# Altium schematic sheet EVK-NORA-W1_SCHEM_0004_Interface_FTDI.SchDoc
size B; Date: 7/24/2020; CompanyName: U-blox; DrawnBy: EMOO; Engineer: EMOO; Organization: U-blox; Address1: 3950 Fairview Industrial Dr SE #100; Address2: Salem, OR 97302; SheetNumber: 6; SheetTotal: 6; SheetSize: B; SheetTitle: Interface MCU
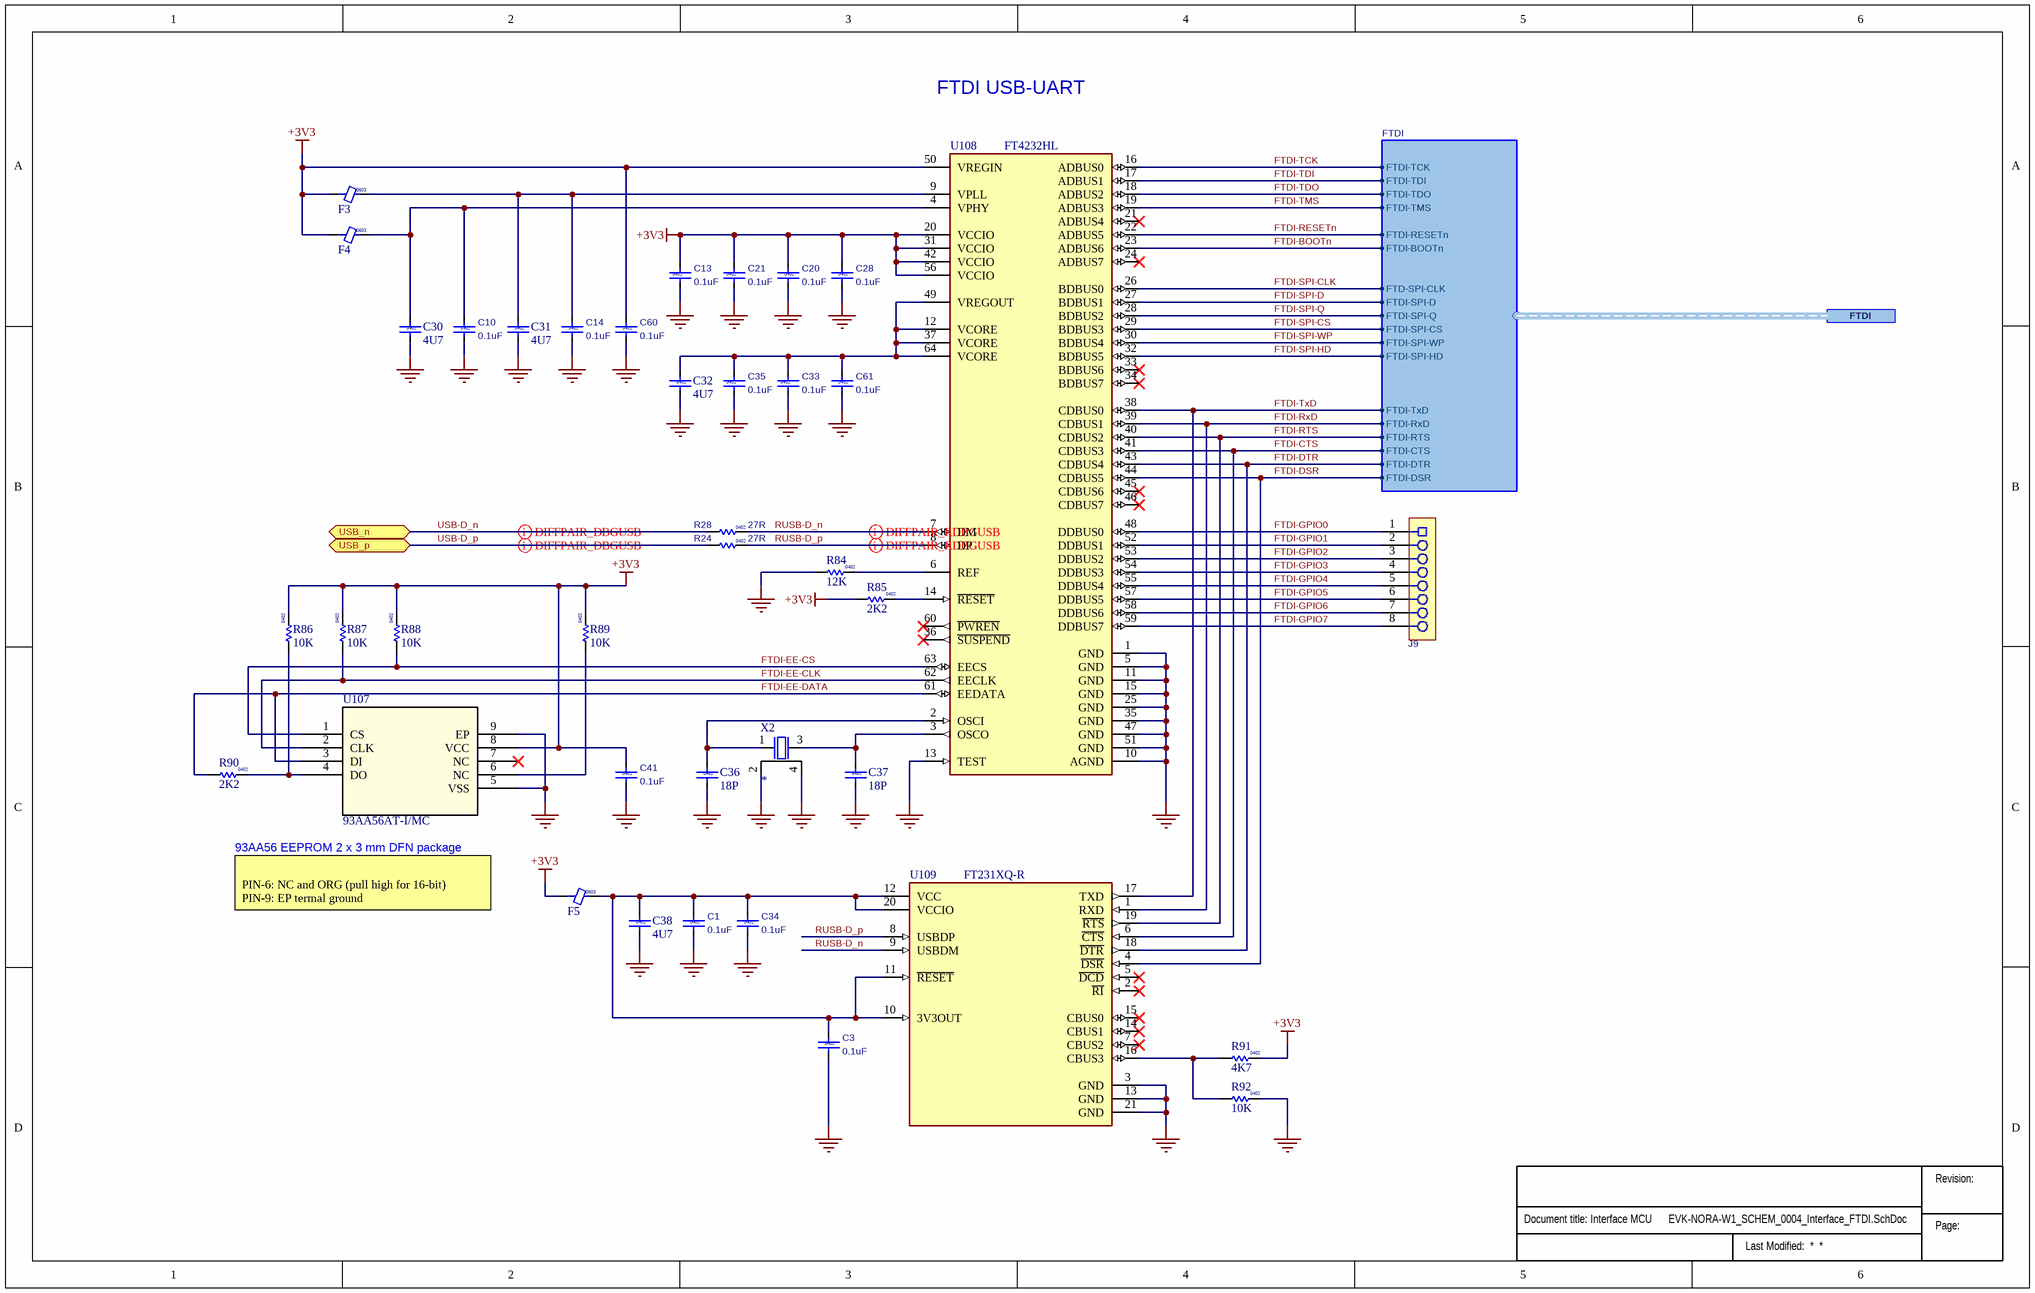
[diagram p0: EVK-NORA-W1_SCHEM_0004_Interface_FTDI.SchDoc]

## Parts
?  (no value)  (graphical)
C1  value 0.1uF  Size: 0402  [Cap 0402 HD]  (hidden comment: 120-000160.1uF)
C3  value 0.1uF  Size: 0402  [Cap 0402 HD]  (hidden comment: 120-000160.1uF)
C10  value 0.1uF  Size: 0402  [Cap 0402 HD]  (hidden comment: 120-000160.1uF)
C13  value 0.1uF  Size: 0402  [Cap 0402 HD]  (hidden comment: 120-000160.1uF)
C14  value 0.1uF  Size: 0402  [Cap 0402 HD]  (hidden comment: 120-000160.1uF)
C20  value 0.1uF  Size: 0402  [Cap 0402 HD]  (hidden comment: 120-000160.1uF)
C21  value 0.1uF  Size: 0402  [Cap 0402 HD]  (hidden comment: 120-000160.1uF)
C28  value 0.1uF  Size: 0402  [Cap 0402 HD]  (hidden comment: 120-000160.1uF)
C30  value 4U7  Size: 0402  [Cap 0402 HD]
C31  value 4U7  Size: 0402  [Cap 0402 HD]
C32  value 4U7  Size: 0402  [Cap 0402 HD]
C33  value 0.1uF  Size: 0402  [Cap 0402 HD]  (hidden comment: 120-000160.1uF)
C34  value 0.1uF  Size: 0402  [Cap 0402 HD]  (hidden comment: 120-000160.1uF)
C35  value 0.1uF  Size: 0402  [Cap 0402 HD]  (hidden comment: 120-000160.1uF)
C36  value 18P  Size: 0402  [Cap 0402]
C37  value 18P  Size: 0402  [Cap 0402]
C38  value 4U7  Size: 0402  [Cap 0402 HD]
C41  value 0.1uF  Size: 0402  [Cap 0402 HD]  (hidden comment: 120-000160.1uF)
C60  value 0.1uF  Size: 0402  [Cap 0402 HD]  (hidden comment: 120-000160.1uF)
C61  value 0.1uF  Size: 0402  [Cap 0402 HD]  (hidden comment: 120-000160.1uF)
F3  Size: 0603  [IND 0603 HD]
F4  Size: 0603  [IND 0603 HD]
F5  Size: 0603  [IND 0603 HD]
J9  (no value)  [SKT-0.1P-SSM-108-L-SV]
R24  value 27R  Size: 0402  [RES 0402 HD]
R28  value 27R  Size: 0402  [RES 0402 HD]
R84  value 12K  Size: 0402  [RES 0402 HD]
R85  value 2K2  Size: 0402  [RES 0402 HD]
R86  value 10K  Size: 0402  [RES 0402 HD]
R87  value 10K  Size: 0402  [RES 0402 HD]
R88  value 10K  Size: 0402  [RES 0402 HD]
R89  value 10K  Size: 0402  [RES 0402 HD]
R90  value 2K2  Size: 0402  [RES 0402 HD]
R91  value 4K7  Size: 0402  [RES 0402 HD]
R92  value 10K  Size: 0402  [RES 0402 HD]
U107  93AA56AT-I/MC  [DFN0.5P-8Pin_W-Pad]
U108  FT4232HL  [QFP0.5P16x16-64Pin_HD]
U109  FT231XQ-R  [QFN_5x5_FT231XQ]
X2  (no value)  [XTAL_3225]

## Ports
FTDI (harness FTDI), USB_n (bidir), USB_p (bidir)

## Harnesses
FTDI: FTDI-TCK, FTDI-TDI, FTDI-TDO, FTDI-TMS, FTDI-RESETn, FTDI-BOOTn, FTD-SPI-CLK, FTDI-SPI-D, FTDI-SPI-Q, FTDI-SPI-CS, FTDI-SPI-WP, FTDI-SPI-HD, FTDI-TxD, FTDI-RxD, FTDI-RTS, FTDI-CTS, FTDI-DTR, FTDI-DSR

## Nets
+3V3: C13.1 C20.1 C21.1 C28.1 C41.1 C60.1 F3.1 F4.1 F5.1 R85.1 R86.2 R87.2 R88.2 R89.2 R91.2 U107.8(VCC) U108.20(VCCIO) U108.31(VCCIO) U108.42(VCCIO) U108.50(VREGIN) U108.56(VCCIO)
GND: C1.2 C3.2 C10.2 C13.2 C14.2 C20.2 C21.2 C28.2 C30.2 C31.2 C32.2 C33.2 C34.2 C35.2 C36.2 C37.2 C38.2 C41.2 C60.2 C61.2 R84.1 R92.2 U107.5(VSS) U107.9(EP) U108.1(GND) U108.5(GND) U108.10(AGND) U108.11(GND) U108.13(TEST) U108.15(GND) U108.25(GND) U108.35(GND) U108.47(GND) U108.51(GND) U109.3(GND) U109.13(GND) U109.21(GND) X2.2 X2.4
FTDI-BOOTn: U108.23(ADBUS6) ; port FTDI.FTDI-BOOTn
FTDI-CTS: U108.41(CDBUS3) U109.6(~{CTS}) ; port FTDI.FTDI-CTS
FTDI-DSR: U108.44(CDBUS5) U109.4(~{DSR}) ; port FTDI.FTDI-DSR
FTDI-DTR: U108.43(CDBUS4) U109.18(~{DTR}) ; port FTDI.FTDI-DTR
FTDI-EE-CLK: R87.1 U107.2(CLK) U108.62(EECLK)
FTDI-EE-CS: R88.1 U107.1(CS) U108.63(EECS)
FTDI-EE-DATA: R90.1 U107.3(DI) U108.61(EEDATA)
FTDI-GPIO0: J9.1 U108.48(DDBUS0)
FTDI-GPIO1: J9.2 U108.52(DDBUS1)
FTDI-GPIO2: J9.3 U108.53(DDBUS2)
FTDI-GPIO3: J9.4 U108.54(DDBUS3)
FTDI-GPIO4: J9.5 U108.55(DDBUS4)
FTDI-GPIO5: J9.6 U108.57(DDBUS5)
FTDI-GPIO6: J9.7 U108.58(DDBUS6)
FTDI-GPIO7: J9.8 U108.59(DDBUS7)
FTDI-RESETn: U108.22(ADBUS5) ; port FTDI.FTDI-RESETn
FTDI-RTS: U108.40(CDBUS2) U109.19(~{RTS}) ; port FTDI.FTDI-RTS
FTDI-RxD: U108.39(CDBUS1) U109.1(RXD) ; port FTDI.FTDI-RxD
FTDI-SPI-CLK: U108.26(BDBUS0) ; port FTDI.FTD-SPI-CLK
FTDI-SPI-CS: U108.29(BDBUS3) ; port FTDI.FTDI-SPI-CS
FTDI-SPI-D: U108.27(BDBUS1) ; port FTDI.FTDI-SPI-D
FTDI-SPI-HD: U108.32(BDBUS5) ; port FTDI.FTDI-SPI-HD
FTDI-SPI-Q: U108.28(BDBUS2) ; port FTDI.FTDI-SPI-Q
FTDI-SPI-WP: U108.30(BDBUS4) ; port FTDI.FTDI-SPI-WP
FTDI-TCK: U108.16(ADBUS0) ; port FTDI.FTDI-TCK
FTDI-TDI: U108.17(ADBUS1) ; port FTDI.FTDI-TDI
FTDI-TDO: U108.18(ADBUS2) ; port FTDI.FTDI-TDO
FTDI-TMS: U108.19(ADBUS3) ; port FTDI.FTDI-TMS
FTDI-TxD: U108.38(CDBUS0) U109.17(TXD) ; port FTDI.FTDI-TxD
RUSB-D_n: R28.1 U108.7(DM) U109.9(USBDM)
RUSB-D_p: R24.1 U108.8(DP) U109.8(USBDP)
USB-D_n: R28.2 ; port USB_n
USB-D_p: R24.2 ; port USB_p
NetC1_1: C1.1 C3.1 C34.1 C38.1 F5.2 U109.10(3V3OUT) U109.11(~{RESET}) U109.12(VCC) U109.20(VCCIO)
NetC10_1: C10.1 C30.1 F4.2 U108.4(VPHY)
NetC14_1: C14.1 C31.1 F3.2 U108.9(VPLL)
NetC32_1: C32.1 C33.1 C35.1 C61.1 U108.12(VCORE) U108.37(VCORE) U108.49(VREGOUT) U108.64(VCORE)
NetC36_1: C36.1 U108.2(OSCI) X2.1
NetC37_1: C37.1 U108.3(OSCO) X2.3
NetR84_2: R84.2 U108.6(REF)
NetR85_2: R85.2 U108.14(~{RESET})
NetR86_1: R86.1 R90.2 U107.4(DO)
NetR89_1: R89.1 U107.6(NC)
NetR91_1: R91.1 R92.1 U109.16(CBUS3)

Not connected (* = marked no-connect by the designer): U107 7(NC)*; U108 21(ADBUS4)* 24(ADBUS7)* 33(BDBUS6)* 34(BDBUS7)* 36(~{SUSPEND})* 45(CDBUS6)* 46(CDBUS7)* 60(~{PWREN})*; U109 2(~{RI})* 5(~{DCD})* 7(CBUS2)* 14(CBUS1)* 15(CBUS0)*

## Layout directives
differential pair; net class USB_DIFF: RUSB-D_n, RUSB-D_p, USB-D_n, USB-D_p

## Notes on the sheet
- FTDI USB-UART
- 93AA56 EEPROM 2 x 3 mm DFN package
- PIN-6: NC and ORG (pull high for 16-bit)
  PIN-9: EP termal ground
- Revision:
- Page:

## Library data of the parts
? = Sub_Title_Block: Minimized schematic title block for all subset sheets
C1 C3 C10 C13 C14 C20 C21 C28 C33-C35 C41 C60 C61 = 120-00016: Cap, Ceramic 0.1uF 10V 10% X5R 0402; Part Name: CAP CER 0.1UF 10V 10% X5R 0402; Part_Type: Ceramic Capacitor; Manufacturer: Murata Electronics North America; Manufacturer P/N: GRM155R61A104KA01J; Item_Phase: Production; Component Mounting Type: SMT; Tolerance: +/- 10%; Use in new designs: Yes; Part Number: 120-00016; Revision: 0A; Supplier 1: Digi-Key; Supplier Part Number 1: 490-6297-1-ND; Manufacturer 2: Yageo; Manufacturer P/N 2: CC0402KRX5R6BB104; Supplier 2: Digi-Key; Supplier Part Number 2: 311-1336-1-ND; Arena Link: https://app.bom.com/a/GYHPV2L2L43KRMBK?v=spec.summary; Height: 0.55mm; Pins: 2; Temperature Coefficient: X5R; Voltage: 10V
C30-C32 C38 = UBXH01-0000243: CAP CER X5R 0402 4U7 20% 10V; Manufacturer: Murata Manufacturing Company, Ltd.; Manufacturer P/N: GRM155R61A475MEAA; Editor: martin.pilik; Released by: fabrice.bret-dibat; Env: GREEN; Permitted Use: Volume Products; Perferred: PREF; Mfg P/N Status: Active; Mfg P/N Split: 100; Mfg P/N Released: Yes; Part Number: UBXH01-0000243; Tolerance: 20%; Max Voltage: 10V; Min Operating Temp: -40°C; Max Operating Temp: 85°C; Part Type: Capacitor; Release Data: 2021-05-10 12:57:47.325652; UBX Wiki: https://wiki.u-blox.com/bin/view/Operations/PartDetails?index=24303; RefDes: C; Mfg P/N Datasheet: https://wiki.u-blox.com/bin/view/Generic/Docs/DocumentSummary?index=24302
C36 C37 = UBXH01-0004017: CAP CER C0G 0402 18P 5% 25V; Manufacturer: Murata Manufacturing Company, Ltd.; Manufacturer P/N: GRM1555C1H180JA01; Editor: doris.zahnd; Released by: daniel.hurni; Env: ROHS; Permitted Use: Volume Products; Perferred: PREF; Mfg P/N Status: NRND; Mfg P/N Split: 100; Mfg P/N Released: Yes; Part Number: UBXH01-0004017; Tolerance: 5%; Max Voltage: 25V; Min Operating Temp: -55°C; Max Operating Temp: 125°C; Part Type: Capacitor; Release Data: 2009-12-03 17:48:42.813059; UBX Wiki: https://wiki.u-blox.com/bin/view/Operations/PartDetails?index=5178; RefDes: C; Manufacturer 2: Murata Manufacturing Company, Ltd.; Manufacturer P/N 2: GRM1555C1E180JZ01; Mfg P/N Status 2: Obsolete; Mfg P/N Split 2: 0; Mfg P/N Released 2: Yes; Manufacturer 3: Murata Manufacturing Company, Ltd.; Manufacturer P/N 3: GRM1555C1H180JZ01; Mfg P/N Status 3: Obsolete; Mfg P/N Split 3: 0; Mfg P/N Released 3: Yes
F3-F5 = UBXH08-0000001: FERRITE BEAD 0603 600 OHM AT 100MHZ 600OHM 500mA; Manufacturer: TDK Corporation; Manufacturer P/N: MMZ1608B601C; Editor: daniel.hurni; Released by: martin.frauchiger; Env: ROHS; Permitted Use: Support Products; Perferred: PREF; Mfg P/N Status: Active; Mfg P/N Split: 100; Mfg P/N Released: Yes; Part Number: UBXH08-0000001; Value: 600OHM; Max Current: 500mA; Min Operating Temp: -40°C; Max Operating Temp: 125°C; Part Type: Ferrite; Release Data: 2009-12-02 10:18:36.177919; UBX Wiki: https://wiki.u-blox.com/bin/view/Operations/PartDetails?index=7960; RefDes: FB; Mfg P/N Datasheet: https://wiki.u-blox.com/bin/view/Generic/Docs/DocumentSummary?index=7941
J9 = 130-00102: Socket Strip 0.1" 8 Pin 1Row SMD Black; Manufacturer 1: Seeed Technology; Manufacturer Part Number 1: Rigado 130-00102; Part Name: CON SKT Strip 0.1" 8Pin 1Row SMD Black; Item Phase: In Production; Use in new designs: Yes; Voltage: 572VDC; UBX Code: None; Part Number: 130-00102; Supplier 1: Seeed Technology; Supplier Part Number 1: Rigado 130-00102; Diameter: None; Height: 7.37mm; Max Operating Temp: 105; Min Operating Temp: -55; Pins: 8; Revision: 0C; Manufacturer 2: Samtec; Manufacturer Part Number 2: SSM-108-F-SV-P-TR; Supplier 2: Avnet; Supplier Part Number 2: SSM-108-F-SV-P-TR
R24 R28 = 180-00125: Resistor, 27ohm, 1%, 1/16W, 0402; Part Name: RES SMD 27 OHM 1% 1/16W 0402; Manufacturer: Panasonic Electronic Components; Manufacturer P/N: ERJ-2RKF27R0X; Item_Phase: Production; Component Mounting Type: SMT; Tolerance: +/- 1%; Use in new designs: Yes; Part Number: 180-00125; Part_Type: Resistor; Supplier 1: Digi-Key; Supplier Part Number 1: P27.0LCT-ND; Arena Link: https://app.bom.com/a/O6PX3ATATCBPKZ3N?v=spec.summary; Height: 0.4mm; Pins: 2; Power: 1/16W; Revision: 0C; Manufacturer 2: Samsung Electro-Mechanics America, Inc; Manufacturer P/N 2: RC1005F270CS; Supplier 2: Digi-Key; Supplier Part Number 2: 1276-3907-1-ND; Alternate Footprint Ref: RES 0402
R84 = UBXH18-0000137: RES THICK FILM CHIP 0402 12K 1% 63mW; Manufacturer: Vishay; Manufacturer P/N: CRCW040212K0FKED; Editor: matej.budin; Released by: gabriele.capello; Env: ROHS; Permitted Use: Support Products; Perferred: PREF; Mfg P/N Status: Active; Mfg P/N Split: 100; Mfg P/N Released: Yes; Part Number: UBXH18-0000137; Tolerance: 1%; Max Power: 63mW; Min Operating Temp: -55°C; Max Operating Temp: 125°C; Part Type: Resistor; Release Data: 2014-08-26 10:20:00.142219; UBX Wiki: https://wiki.u-blox.com/bin/view/Operations/PartDetails?index=21075; RefDes: R; Mfg P/N Datasheet: https://wiki.u-blox.com/bin/view/Generic/Docs/DocumentSummary?index=21077
R85 R90 = UBXH18-0008057: RES THICK FILM CHIP 0402 2K2 5% 100mW; Manufacturer: YAGEO; Manufacturer P/N: 2322_705_87222_L; Editor: roland.rust; Env: ROHS; Permitted Use: Volume Products; Perferred: PREF; Mfg P/N Status: NRND; Mfg P/N Split: 100; Mfg P/N Released: Yes; Part Number: UBXH18-0008057; Tolerance: 5%; Max Power: 100mW; Part Type: Resistor; Released by: roland.rust; Release Data: 2007-02-09 10:46:57; UBX Wiki: https://wiki.u-blox.com/bin/view/Operations/PartDetails?index=6956; RefDes: R; Manufacturer 2: YAGEO; Manufacturer P/N 2: RC0402JR-072K2L; Mfg P/N Status 2: Active; Mfg P/N Split 2: 0; Mfg P/N Released 2: Yes; Mfg P/N Datasheet 2: https://wiki.u-blox.com/bin/view/Generic/Docs/DocumentSummary?index=8163
R86-R89 R92 = UBXH18-0008073: RES THICK FILM CHIP 0402 10K 5% 100mW; Manufacturer: KOA; Manufacturer P/N: RK73B1ETTD103J; Editor: martin.frauchiger; Env: ROHS; Permitted Use: Volume Products; Perferred: PREF; Mfg P/N Status: NRND; Mfg P/N Split: 100; Mfg P/N Released: Yes; Part Number: UBXH18-0008073; Tolerance: 5%; Max Power: 100mW; Part Type: Resistor; Released by: martin.frauchiger; Release Data: 2005-08-19 10:42:45; UBX Wiki: https://wiki.u-blox.com/bin/view/Operations/PartDetails?index=6981; RefDes: R; Manufacturer 2: YAGEO; Manufacturer P/N 2: RC0402JR-0710KL; Mfg P/N Status 2: Active; Mfg P/N Split 2: 0; Mfg P/N Released 2: No; Manufacturer 3: YAGEO; Manufacturer P/N 3: 2322_705_87103_L; Mfg P/N Status 3: NRND; Mfg P/N Split 3: 0; Mfg P/N Released 3: Yes
R91 = UBXH18-0008065: RES THICK FILM CHIP 0402 4K7 5% 100mW; Manufacturer: YAGEO; Manufacturer P/N: 2322_705_70472_L; Editor: martin.frauchiger; Env: ROHS; Permitted Use: Volume Products; Perferred: PREF; Mfg P/N Status: NRND; Mfg P/N Split: 100; Mfg P/N Released: Yes; Part Number: UBXH18-0008065; Tolerance: 5%; Max Power: 100mW; Part Type: Resistor; Released by: martin.frauchiger; Release Data: 2005-08-19 10:42:45; UBX Wiki: https://wiki.u-blox.com/bin/view/Operations/PartDetails?index=6969; RefDes: R; Manufacturer 2: KOA; Manufacturer P/N 2: RK73B1ETTD472J; Mfg P/N Status 2: NRND; Mfg P/N Split 2: 0; Mfg P/N Released 2: Yes
U107 = UBXH13-0000121: EEPROM SERIAL 2KBIT 256 X 8 1.8-5.5V DFN-8PIN-2X3MM 5.5V; Mfr_Name: Microchip; Value: 93AA56AT-I/OT; Editor: hakan.ekfors; Env: ROHS; Permitted Use: Volume Products; Perferred: PREF; Mfg P/N Status: Active; Mfg P/N Split: 100; Mfg P/N Released: No; Copyright: Copyright (C) 2022 Ultra Librarian. All rights reserved.; Manufacturer_Part_Number: 93AA56AT-I/MC; Digi-Key_Part_Number_1: 93AA56AT-I/MCCT-ND; Digi-Key_Part_Number_2: 93AA56AT-I/MCDKR-ND; Digi-Key_Part_Number_3: 93AA56AT-I/MCTR-ND; RefDes: U; Type: DEV; Part Number: UBXH13-0000121; Max Voltage: 5.5V; Min Operating Temp: -40°C; Max Operating Temp: 85°C; Part Type: Memory; UBX Wiki: https://wiki.u-blox.com/bin/view/Operations/PartDetails?index=36436; Manufacturer: Microchip; Manufacturer P/N: 93AA56AT-I/OT; Mfg P/N Datasheet: https://wiki.u-blox.com/bin/view/Generic/Docs/DocumentSummary?index=20290
U108 = UBXH10-0000092: FTDI FT4232HL QUAD HIGH SPEED USB TO MULTIPURPOSE UART LQFP-64; Manufacturer: FTDI Future Technology Devices International; Editor: olof.viklund; Released by: aneeb.sohail; Env: ROHS; Permitted Use: Support Products; Perferred: PREF; Mfg P/N Status: Active; Mfg P/N Split: 100; Mfg P/N Released: No; Part Number: UBXH10-0000092; Value: FT4232HL; Min Operating Temp: -40°C; Max Operating Temp: 85°C; Part Type: Interface; Release Data: 2021-08-27 14:44:23.358237; UBX Wiki: https://wiki.u-blox.com/bin/view/Operations/PartDetails?index=35482; RefDes: U; Manufacturer P/N: FT4232HL; Mfg P/N Datasheet: https://wiki.u-blox.com/bin/view/Generic/Docs/DocumentSummary?index=16016
U109 = UBXH10-0000054: FTDI USB TO SERIAL FULL UART INTERFACE QFN20; Manufacturer: FTDI Future Technology Devices International; Editor: adam.johansson; Env: ROHS; Permitted Use: Support Products; Perferred: PREF; Mfg P/N Status: Active; Mfg P/N Split: 100; Mfg P/N Released: No; Part Number: UBXH10-0000054; Value: FT231XQ-R; Min Operating Temp: -40°C; Max Operating Temp: 85°C; Part Type: Interface; UBX Wiki: https://wiki.u-blox.com/bin/view/Operations/PartDetails?index=27258; RefDes: U; Manufacturer P/N: FT231XQ-R; Mfg P/N Datasheet: https://wiki.u-blox.com/bin/view/Generic/Docs/DocumentSummary?index=33707
X2 = 100-00006: XTAL, 4Pin, 12.0000MHz, 18pF, 20ppm, 4Pins; Manufacturer 1: Abracon LLC; Manufacturer Part Number 1: ABM8-12.000MHZ-B2-T; Part Name: XTAL 12MHz 18pF 20ppm 3225; Body Size: 3.2mm x 2.5mm; Item Phase: Unreleased; MFG Package: 4-SMD; Use in new designs: Yes; Voltage: None; Value: *; Part Number: 100-00006; Supplier 1: Digi-Key; Supplier Part Number 1: 535-9826-1-ND; Manufacturer 2: AVX Corporation; Manufacturer Part Number 2: CX3225GB12000P0HPQCC; Supplier 2: Digi-Key; Supplier Part Number 2: 1253-1168-1-ND; Height: 0.8mm; Max Operating Temp: 75; Min Operating Temp: -20; Pins: 4; Revision: None; UBX Code: None